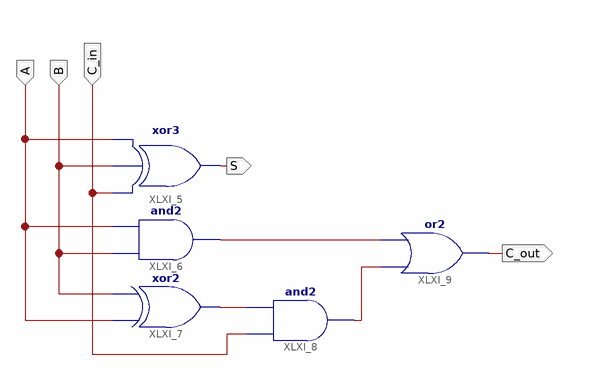
[diagram p0: schematic sheet 1]
// Xilinx ISE schematic FA1bit_schema.sch (spartan3e) as structural Verilog: 5 symbols, 5 ports
module FA1bit_schema (
  input  B,
  input  A,
  input  C_in,
  output S,
  output C_out
);

  wire XLXN_18, XLXN_19, XLXN_20;

  xor XLXI_5 (S, C_in, B, A);
  and XLXI_6 (XLXN_19, B, A);
  xor XLXI_7 (XLXN_18, A, B);
  and XLXI_8 (XLXN_20, C_in, XLXN_18);
  or XLXI_9 (C_out, XLXN_20, XLXN_19);
endmodule
